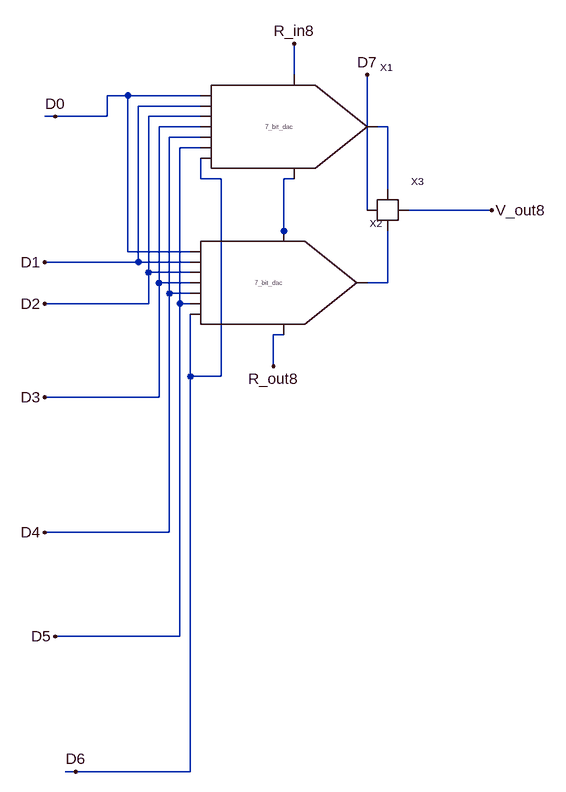
[diagram p0: schematic 8_bit_dac.asc]
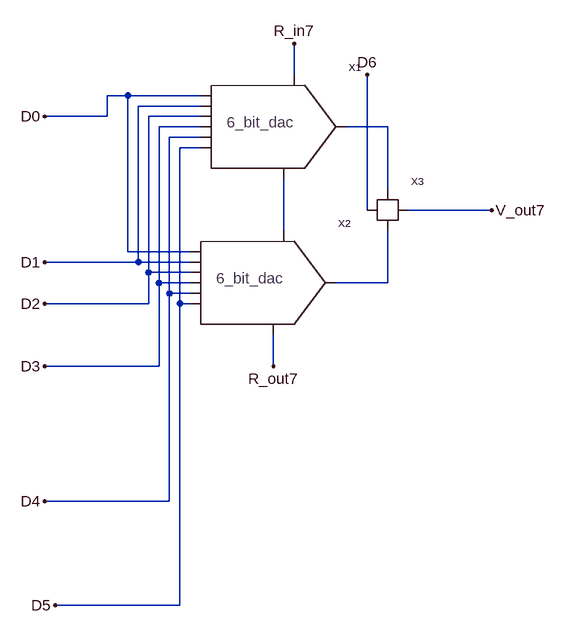
[diagram p1: sub-circuit 7_bit_dac.asc]
8_bit_dac.asc, the LTspice schematic file:
Version 4
SHEET 1 880 1164
WIRE 288 32 288 -16
WIRE 32 64 0 64
WIRE 144 64 32 64
WIRE 144 80 48 80
WIRE -80 96 -96 96
WIRE 0 96 0 64
WIRE 0 96 -80 96
WIRE 144 96 64 96
WIRE 144 112 80 112
WIRE 432 112 416 112
WIRE 144 128 96 128
WIRE 144 144 112 144
WIRE 144 192 144 160
WIRE 176 192 144 192
WIRE 288 192 272 192
WIRE 432 208 432 112
WIRE 400 240 400 32
WIRE 592 240 464 240
WIRE 272 272 272 192
WIRE 272 288 272 272
WIRE 32 304 32 64
WIRE 128 304 32 304
WIRE 48 320 48 80
WIRE 48 320 -96 320
WIRE 128 320 48 320
WIRE 64 336 64 96
WIRE 128 336 64 336
WIRE 80 352 80 112
WIRE 128 352 80 352
WIRE 432 352 432 272
WIRE 432 352 400 352
WIRE 96 368 96 128
WIRE 128 368 96 368
WIRE 64 384 64 336
WIRE 64 384 -96 384
WIRE 112 384 112 144
WIRE 128 384 112 384
WIRE 272 432 256 432
WIRE 256 480 256 432
WIRE 128 496 128 400
WIRE 176 496 176 192
WIRE 176 496 128 496
WIRE 80 528 80 352
WIRE 80 528 -96 528
WIRE 96 736 96 368
WIRE 96 736 -96 736
WIRE 112 896 112 384
WIRE 112 896 -80 896
WIRE -48 1104 -64 1104
WIRE 128 1104 128 496
WIRE 128 1104 -48 1104
FLAG 592 240 V_out8
FLAG -80 96 D0
FLAG -96 320 D1
FLAG -96 384 D2
FLAG -96 528 D3
FLAG 288 -16 R_in8
FLAG 400 32 D7
FLAG 256 480 R_out8
FLAG -96 736 D4
FLAG -80 896 D5
FLAG -48 1104 D6
SYMBOL switch 432 240 R0
SYMATTR InstName X3
SYMBOL 7_bit_dac 224 112 R0
SYMATTR InstName X1
SYMBOL 7_bit_dac 208 352 R0
SYMATTR InstName X2

7_bit_dac.asc, the sub-circuit schematic file:
Version 4
SHEET 1 880 996
WIRE 288 32 288 -16
WIRE 32 64 0 64
WIRE 144 64 32 64
WIRE 144 80 48 80
WIRE 0 96 0 64
WIRE 0 96 -96 96
WIRE 144 96 64 96
WIRE 144 112 80 112
WIRE 432 112 368 112
WIRE 144 128 96 128
WIRE 144 144 112 144
WIRE 432 208 432 112
WIRE 400 240 400 32
WIRE 592 240 464 240
WIRE 272 272 272 192
WIRE 32 304 32 64
WIRE 128 304 32 304
WIRE 48 320 48 80
WIRE 48 320 -96 320
WIRE 128 320 48 320
WIRE 64 336 64 96
WIRE 128 336 64 336
WIRE 80 352 80 112
WIRE 128 352 80 352
WIRE 432 352 432 272
WIRE 432 352 352 352
WIRE 96 368 96 128
WIRE 128 368 96 368
WIRE 64 384 64 336
WIRE 64 384 -96 384
WIRE 112 384 112 144
WIRE 128 384 112 384
WIRE 80 480 80 352
WIRE 80 480 -96 480
WIRE 256 480 256 432
WIRE 96 688 96 368
WIRE 96 688 -96 688
WIRE 112 848 112 384
WIRE 112 848 -80 848
FLAG 592 240 V_out7
FLAG -96 96 D0
FLAG -96 320 D1
FLAG -96 384 D2
FLAG -96 480 D3
FLAG -96 688 D4
FLAG -80 848 D5
FLAG 256 480 R_out7
FLAG 288 -16 R_in7
FLAG 400 32 D6
SYMBOL switch 432 240 R0
SYMATTR InstName X3
SYMBOL 6_bit_dac 240 112 R0
SYMATTR InstName X1
SYMBOL 6_bit_dac 224 352 R0
SYMATTR InstName X2

The netlist it stands for:
* 8_bit_dac.asc
XX3 D7 N001 N003 V_out8 switch  ; pins digital_input Vin_1 Vin_2 Vout
XX1 D0 D1 D2 D3 D4 D5 D6 R_in8 N002 N001 7_bit_dac
XX2 D0 D1 D2 D3 D4 D5 D6 N002 R_out8 N003 7_bit_dac

* block symbol definitions
.subckt 7_bit_dac D0 D1 D2 D3 D4 D5 D6 R_in7 R_out7 V_out7
XX3 D6 N001 N003 V_out7 switch  ; pins digital_input Vin_1 Vin_2 Vout
XX1 D0 D1 D2 D3 D4 D5 N001 R_in7 N002 6_bit_dac  ; pins D0 D1 D2 D3 D4 D5 V_out6 R_in6 R_out6
XX2 D0 D1 D2 D3 D4 D5 N003 N002 R_out7 6_bit_dac  ; pins D0 D1 D2 D3 D4 D5 V_out6 R_in6 R_out6
.ends 7_bit_dac

.backanno
.end